# EAGLE design AutoISP84 (EAGLE 7.2.0)
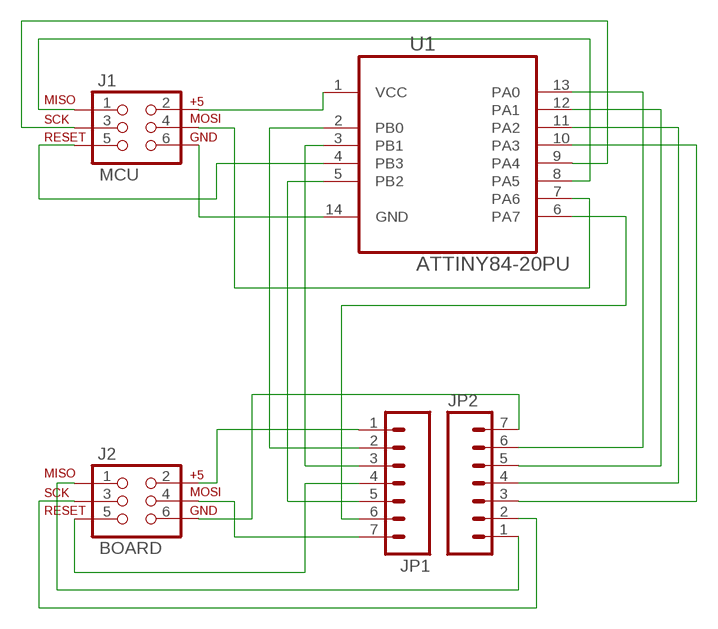
[diagram p0: schematic, sheet 1]

## Parts
J1  MCU  AVR_SPI_PRG_6PTH  [2X3]
J2  BOARD  AVR_SPI_PRG_6PTH  [2X3]
JP1  M07  [1X07]
JP2  M07  [1X07]
U1  ATTINY84-20PU  [DIP254P762X533-14]

## Nets
N$1: J1.2 U1.1(VCC)
N$2: J2.2 JP1.1
N$3: J2.6 JP2.7
N$4: J1.6 U1.14(GND)
N$5: J1.5 U1.4(PB3)
N$6: J1.3 U1.9(PA4)
N$7: J2.5 JP1.4
N$8: J1.4 U1.7(PA6)
N$10: J1.1 U1.8(PA5)
N$12: JP2.6 U1.13(PA0)
N$14: JP1.5 U1.5(PB2)
N$15: JP1.3 U1.3(PB1)
N$16: JP1.2 U1.2(PB0)
N$17: JP1.6 U1.6(PA7)
N$18: JP2.5 U1.12(PA1)
N$19: J2.4 JP1.7
N$20: JP2.4 U1.11(PA2)
N$21: JP2.3 U1.10(PA3)
N$22: J2.1 JP2.1
N$23: J2.3 JP2.2

## Library data of the parts
J1 J2 = SparkFun-Connectors:AVR_SPI_PRG_6: AVR ISP 6 Pin This is the reduced ISP connector for AVR programming. Common on Arduino. This footprint will take up less PCB space and can be used with a 10-pin to 6-pin adapter such as SKU: BOB-08508
JP1 JP2 = SparkFun-Connectors:M07: Header 7 Standard 7-pin 0.1" header. Use with straight break away headers (SKU : PRT-00116), right angle break away headers (PRT-00553), swiss pins (PRT-00743), machine pins (PRT-00117), and female headers (PRT-00115). NOTES ON THE VARIANTS LOCK and LOCK_LONGPADS... This footprint was designed to help hold the alignment of a through-hole component (i.e. 7-pin header) while soldering it into place. You may notice that each hole has been shifted either up or down by 0.005 of an inch from it's more standard position (which is usually a perfectly straight line). This slight alteration caused the pins (the squares in the middle) to touch the edges of the holes. Because they are alternating, it causes a "brace" to hold the header in place. 0.005 has proven to be the perfect amount of "off-center" position when using our standard breakaway headers. Although looks a little odd when you look at the bare footprint, once you have a header in there, the alteration is very hard to notice. Also, if you push a header all the way into place, it is covered up entirely on the bottom side. This idea of altering the position of holes to aid alignment will be further integrated into the Sparkfun Library for other footprints. It can help hold any component with 3 or more connection pins.
U1 = Atmel_By_element14_Batch_1-00:ATTINY84-20PU: 8-bit Microcontroller with In-System Programmable Flash; MPN: ATTINY84-20PU; OC_FARNELL: -; OC_NEWARK: 58M3794; PACKAGE: PDIP-14; SUPPLIER: Atmel

## Board
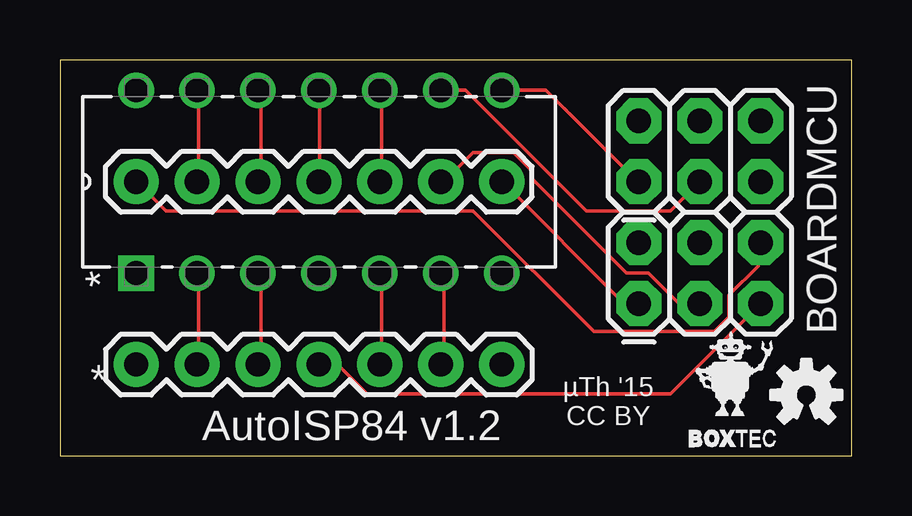
[diagram p1: board, top side]
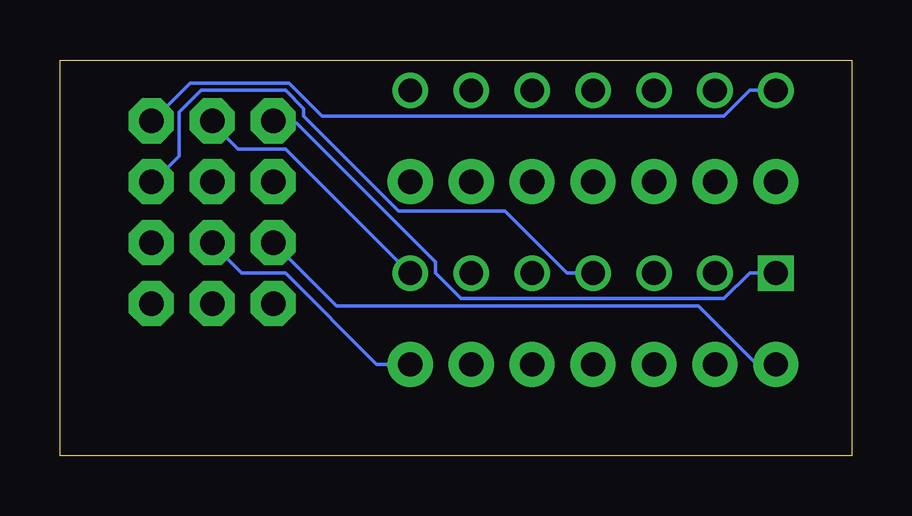
[diagram p2: board, bottom side, seen from below]

Size 33.02 x 16.51 mm. Coordinates in mm from the lower left corner, seen from the top.
Outline: 0,0 33.02,0 33.02,16.51 0,16.51 0,0
Copper layers (1*16): Top 0.0356mm / dielectric 1.5011mm / Bottom 0.0356mm
Design rules "OSHPark": minimum track width 6mil, minimum drill 13mil, track to track 6mil, track to pad 6mil, pad to pad 6mil, via to via 6mil, smd to smd 6mil, copper to edge 15mil, drill to drill 6mil, minimum pad ring 7mil, minimum via ring 7mil, stop-mask expansion 3mil, vias tented up to drill 0mil, thermal gap 10mil

### Footprints (pad centres in the part's own frame; a part is rotated, then mirrored left to right if it is on the bottom)
2X3 = drill 1.016 pad 1.88 octagon: 1 0,0; 2 0,2.54; 3 2.54,0; 4 2.54,2.54; 5 5.08,0; 6 5.08,2.54
1X07 = drill 1.016 pad 1.88: 1 0,0; 2 2.54,0; 3 5.08,0; 4 7.62,0; 5 10.16,0; 6 12.7,0; 7 15.24,0
DIP254P762X533-14 = drill 0.991 square: 1 -7.62,15.24 | drill 0.991: 2 -7.62,12.7; 3 -7.62,10.16; 4 -7.62,7.62; 5 -7.62,5.08; 6 -7.62,2.54; 7 -7.62,0; 8 0,0; 9 0,2.54; 10 0,5.08; 11 0,7.62; 12 0,10.16; 13 0,12.7; 14 0,15.24

### Placement (x,y rotation side)
J1  24.13,11.43 0 top
J2  24.13,6.35 0 top
JP1  3.17,3.81 0 top
JP2  18.41,11.43 180 top
U1  18.41,15.24 90 top
U$1  [OSHW-LOGO-S]  31.11,2.54 0 top
U$2  [ROBOXTEC-VECLOGO-MICRO]  27.94,3.17 0 top

### Tracks (layer width: path | path; a pad name or v marks a point on that pad's centre or on a via)
N$1
  Bottom 0.152: U1.1 4.27,7.62 5.33,6.55 16.31,6.55 17.37,7.62 17.37,8.08 23.16,13.87 24.08,13.87 J1.2
N$2
  Bottom 0.152: JP1.1 3.96,3.81 6.4,6.25 21.49,6.25 J2.2
N$3
  Top 0.152: J2.6 29.11,8.84 29.11,7.92 27.89,6.71 27.89,5.79 27.28,5.18 22.25,5.18 17.22,10.21 4.42,10.21 3.2,11.43 JP2.7
N$4
  Bottom 0.152: U1.14 4.27,15.24 5.33,14.17 22.1,14.17 23.47,15.54 27.58,15.54 29.11,14.02 J1.6
N$5
  Bottom 0.152: U1.4 11.89,7.62 14.48,10.21 18.9,10.21 22.86,14.17 22.86,14.48 23.62,15.24 27.13,15.24 28.04,14.33 28.04,12.5 29.11,11.43 J1.5
N$6
  Top 0.152: U1.9 16.92,15.24 21.95,10.21 25.45,10.21 J1.3
N$7
  Top 0.152: JP1.4 11.58,3.81 12.8,2.59 25.45,2.59 J2.5
N$8
  Bottom 0.152: U1.7 18.44,7.62 23.62,12.8 25.6,12.8 26.67,13.87 J1.4
N$10
  Top 0.152: U1.8 20.27,15.24 24.08,11.43 J1.1
N$12
  Top 0.152: U1.13 5.79,15.24 5.79,11.43 JP2.6
N$14
  Top 0.152: U1.5 13.41,7.62 13.41,3.81 JP1.5
N$15
  Top 0.152: U1.3 8.38,7.62 8.38,3.81 JP1.3
N$16
  Top 0.152: U1.2 5.79,7.62 5.79,3.81 JP1.2
N$17
  Top 0.152: U1.6 16,7.62 16,3.81 JP1.6
N$18
  Top 0.152: U1.12 8.38,15.24 8.38,11.43 JP2.5
N$19
  Bottom 0.152: JP1.7 19.81,3.81 23.62,7.62 25.45,7.62 26.67,8.84 J2.4
N$20
  Top 0.152: U1.11 10.82,15.24 10.82,11.43 JP2.4
N$21
  Top 0.152: U1.10 13.41,15.24 13.41,11.43 JP2.3
N$22
  Top 0.152: J2.1 24.08,6.4 23.47,6.4 18.44,11.43 JP2.1
N$23
  Top 0.152: J2.3 26.67,6.4 25.76,6.4 24.54,7.62 23.62,7.62 19.66,11.58 19.66,11.89 18.9,12.65 17.22,12.65 16,11.43 JP2.2

### Text on the board
tNames: * | AutoISP84 v1.2 | µTh '15 / CC BY